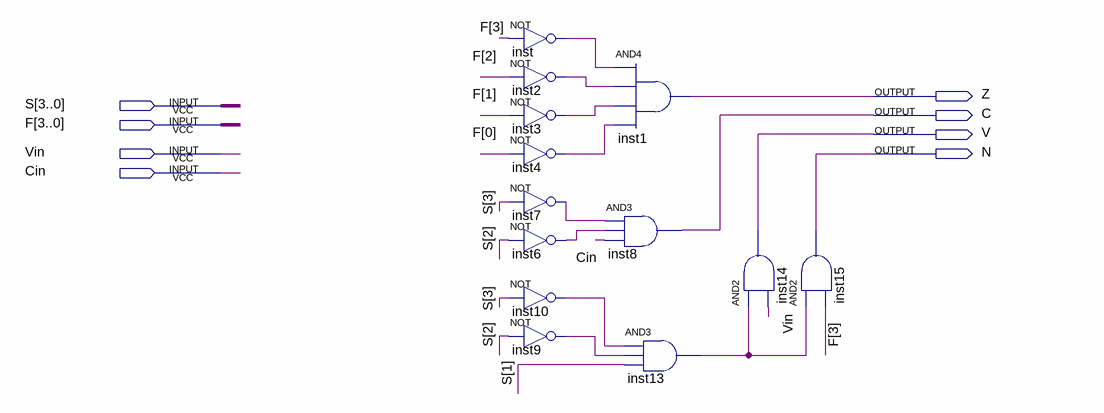
[diagram p0: schematic sheet]
// Quartus schematic FlagUnit.bdf as structural Verilog: 13 symbols, 8 pins
module FlagUnit (
  input  [3:0] S,
  input  [3:0] F,
  input  Vin,
  input  Cin,
  output Z,
  output C,
  output V,
  output N
);

  wire inst2_out, inst3_out, inst4_out, inst6_out, inst7_out, inst9_out, inst10_out, inst13_out, inst_out;

  not inst (inst_out, F[3]);
  not inst2 (inst2_out, F[2]);
  not inst3 (inst3_out, F[1]);
  not inst4 (inst4_out, F[0]);
  not inst7 (inst7_out, S[3]);
  not inst6 (inst6_out, S[2]);
  not inst10 (inst10_out, S[3]);
  not inst9 (inst9_out, S[2]);
  and inst1 (Z, inst_out, inst2_out, inst3_out, inst4_out);
  and inst8 (C, inst7_out, inst6_out, Cin);
  and inst13 (inst13_out, inst10_out, inst9_out, S[1]);
  and inst14 (V, inst13_out, Vin);
  and inst15 (N, inst13_out, F[3]);
endmodule
